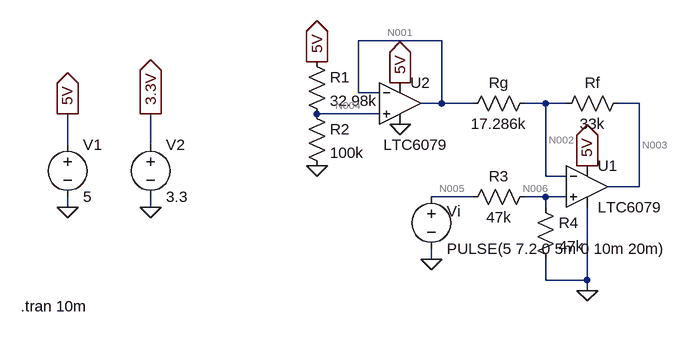
[diagram p0: schematic E344_BatteryReader.asc]
E344_BatteryReader.asc, the LTspice schematic file:
Version 4
SHEET 1 880 680
WIRE -112 0 -240 0
WIRE -240 80 -240 0
WIRE -208 80 -240 80
WIRE -112 96 -112 0
WIRE -112 96 -144 96
WIRE -64 96 -112 96
WIRE 48 96 16 96
WIRE 80 96 48 96
WIRE 192 96 160 96
WIRE -208 112 -304 112
WIRE -688 160 -688 112
WIRE -560 160 -560 112
WIRE 48 208 48 96
WIRE 80 208 48 208
WIRE 192 224 192 96
WIRE 192 224 144 224
WIRE -64 240 -128 240
WIRE 48 240 16 240
WIRE 80 240 48 240
WIRE -688 256 -688 240
WIRE -560 256 -560 240
WIRE 48 256 48 240
WIRE -128 336 -128 320
WIRE 48 368 48 336
WIRE 112 368 112 256
WIRE 112 368 48 368
WIRE 112 384 112 368
FLAG -688 256 0
FLAG -688 112 5V
IOPIN -688 112 Out
FLAG 112 384 0
FLAG 112 192 5V
IOPIN 112 192 Out
FLAG -560 256 0
FLAG -560 112 3.3V
IOPIN -560 112 Out
FLAG -128 336 0
FLAG -304 192 0
FLAG -176 128 0
FLAG -176 64 5V
IOPIN -176 64 Out
FLAG -304 32 5V
IOPIN -304 32 Out
SYMBOL OpAmps\\LTC6079 112 224 R0
SYMATTR InstName U1
SYMBOL voltage -688 144 R0
WINDOW 123 0 0 Left 0
WINDOW 39 0 0 Left 0
SYMATTR InstName V1
SYMATTR Value 5
SYMBOL res 176 80 R90
WINDOW 0 0 56 VBottom 2
WINDOW 3 32 56 VTop 2
SYMATTR InstName Rf
SYMATTR Value 33k
SYMBOL voltage -560 144 R0
WINDOW 123 0 0 Left 0
WINDOW 39 0 0 Left 0
SYMATTR InstName V2
SYMATTR Value 3.3
SYMBOL voltage -128 224 R0
WINDOW 0 24 38 Left 2
WINDOW 123 0 0 Left 0
WINDOW 39 0 0 Left 0
SYMATTR InstName Vi
SYMATTR Value PULSE(5 7.2 0 5m 0 10m 20m)
SYMBOL res 32 80 R90
WINDOW 0 0 56 VBottom 2
WINDOW 3 32 56 VTop 2
SYMATTR InstName Rg
SYMATTR Value 17.286k
SYMBOL res -320 16 R0
SYMATTR InstName R1
SYMATTR Value 32.98k
SYMBOL res -320 96 R0
SYMATTR InstName R2
SYMATTR Value 100k
SYMBOL res 32 224 R90
WINDOW 0 0 56 VBottom 2
WINDOW 3 32 56 VTop 2
SYMATTR InstName R3
SYMATTR Value 47k
SYMBOL res 32 240 R0
SYMATTR InstName R4
SYMATTR Value 47k
SYMBOL OpAmps\\LTC6079 -176 96 R0
WINDOW 3 -26 64 Left 2
SYMATTR InstName U2
TEXT -760 408 Left 2 !.tran 10m

The netlist it stands for:
* E344_BatteryReader.asc
XU1 N006 N002 5V 0 N003 LTC6078  ; LTC6079, pins In+ In- V+ V- OUT
V1 5V 0 5
Rf N003 N002 33k
V2 3.3V 0 3.3
Vi N005 0 PULSE(5 7.2 0 5m 0 10m 20m)
Rg N002 N001 17.286k
R1 5V N004 32.98k
R2 N004 0 100k
R3 N006 N005 47k
R4 N006 0 47k
XU2 N004 N001 5V 0 N001 LTC6078  ; LTC6079, pins In+ In- V+ V- OUT
.tran 10m
.lib LTC5.lib
.backanno
.end

* Results of the author's LTspice run, read from the files saved beside the schematic
* Operating Point, zero values left out:
*   V(5v) = 5 V
*   V(n006) = 2.5 V
*   V(n002) = 2.5 V
*   V(n003) = 94.66 mV
*   V(3.3v) = 3.3 V
*   V(n005) = 5 V
*   V(n001) = 3.76 V
*   V(n004) = 3.76 V
*   I(R4) = 53.19 µA
*   I(R3) = -53.19 µA
*   I(R2) = 37.6 µA
*   I(R1) = 37.6 µA
*   I(Rg) = -72.89 µA
*   I(Rf) = -72.89 µA
*   I(Vi) = -53.19 µA
*   I(V1) = -187.8 µA
*   Ix(u1:3) = 38.78 µA
*   Ix(u1:4) = -111.7 µA
*   Ix(u1:5) = 72.89 µA
*   Ix(u2:3) = 111.4 µA
*   Ix(u2:4) = -38.54 µA
*   Ix(u2:5) = -72.89 µA
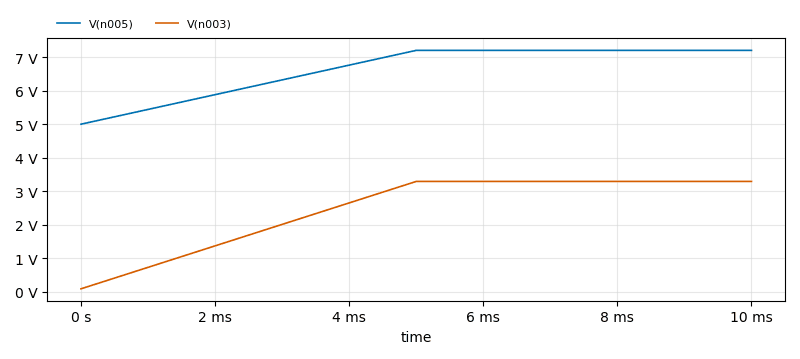
[diagram p1: Transient Analysis of E344_BatteryReader.asc, plotted from the saved traces]
* Transient Analysis, 1 run:
*   V(n005): min 5 V, max 7.2 V, average 6.65 V, rms 6.691 V, last 7.2 V
*   V(n003): min 94.66 mV, max 3.295 V, average 2.494 V, rms 2.715 V, last 3.295 V